# Altium schematic sheet Wheel Module.SchDoc
size A; DocumentNumber: 6; SheetNumber: 8; SheetTotal: 9
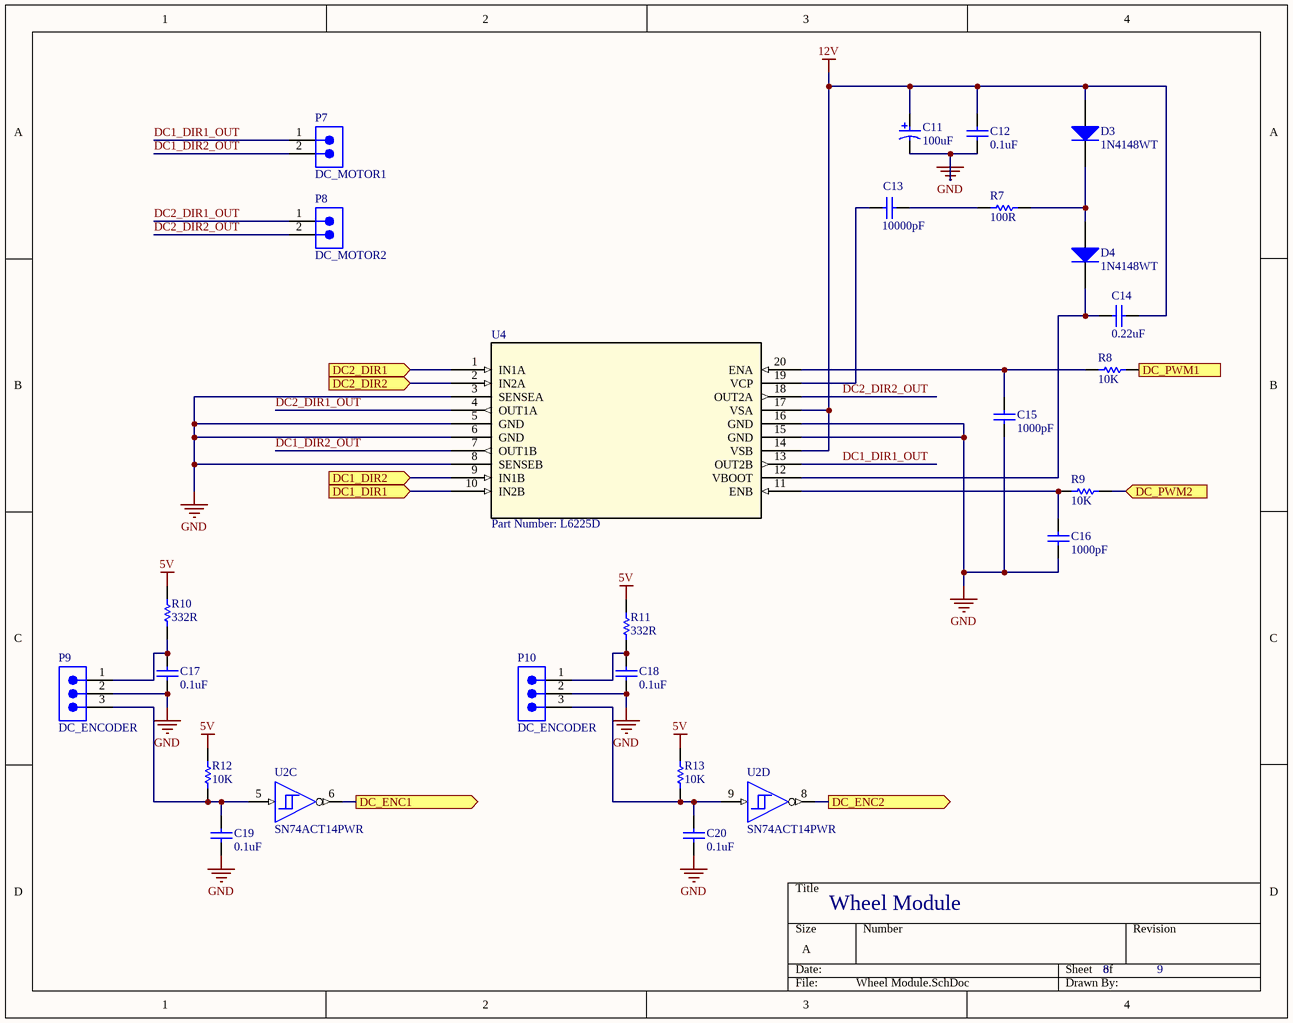
[diagram p0: Wheel Module.SchDoc]

## Parts
C11  100uF  [NIC-CAPA2-6.3X5.8_V]
C12  0.1uF  [CAPC1608X90X35LL15T15]
C13  10000pF  [CAPC1608X90X35LL15T15]
C14  0.22uF  [CAPC1608X90X35ML10T15]
C15  1000pF  [CAPC2013X140X50NL20T25]
C16  1000pF  [CAPC2013X140X50NL20T25]
C17  0.1uF  [CAPC1608X90X35LL15T15]
C18  0.1uF  [CAPC1608X90X35LL15T15]
C19  0.1uF  [CAPC1608X90X35LL15T15]
C20  0.1uF  [CAPC1608X90X35LL15T15]
D3  1N4148WT  [FAIR-SOD-523F-2_V]
D4  1N4148WT  [FAIR-SOD-523F-2_V]
P7  DC_MOTOR1  [SMTC-DW-02-16-X-S-200]
P8  DC_MOTOR2  [SMTC-DW-02-16-X-S-200]
P9  DC_ENCODER  [SMTC-TSW-103-07-X-S]
P10  DC_ENCODER  [SMTC-TSW-103-07-X-S]
R7  100R  [RESC1609X50X30ML10T20]
R8  10K  [RESC1609X50X30ML10T20]
R9  10K  [RESC1609X50X30ML10T20]
R10  332R  [RESC1608X55X30ML15T15]
R11  332R  [RESC1608X55X30ML15T15]
R12  10K  [RESC1609X50X30ML10T20]
R13  10K  [RESC1609X50X30ML10T20]
U2  SN74ACT14PWR  [PW0014A_N]  (parts C,D of 7)
U4  Part Number: L6225D  [SO-20]

## Ports
DC1_DIR1 (in), DC1_DIR2 (in), DC2_DIR1 (in), DC2_DIR2 (in), DC_ENC1 (out), DC_ENC2 (out), DC_PWM1 (in), DC_PWM2 (in)

## Nets
5V: R10.2 R11.2 R12.1 R13.1
12V: C11.1 C12.2 C14.2 D3.2(A) U4.14(VSB) U4.17(VSA)
GND: C11.2 C12.1 C15.1 C16.1 C17.1 C18.1 C19.1 C20.1 P9.2(Ground) P10.2(Ground) U4.3(SENSEA) U4.5(GND) U4.6(GND) U4.8(SENSEB) U4.15(GND) U4.16(GND)
DC1_DIR1: U4.10(IN2B) ; port DC1_DIR1
DC1_DIR1_OUT: P7.1 U4.13(OUT2B)
DC1_DIR2: U4.9(IN1B) ; port DC1_DIR2
DC1_DIR2_OUT: P7.2 U4.7(OUT1B)
DC2_DIR1: U4.1(IN1A) ; port DC2_DIR1
DC2_DIR1_OUT: P8.1 U4.4(OUT1A)
DC2_DIR2: U4.2(IN2A) ; port DC2_DIR2
DC2_DIR2_OUT: P8.2 U4.18(OUT2A)
DC_ENC1: U2.6(~{3Y}) ; port DC_ENC1
DC_ENC2: U2.8(~{4Y}) ; port DC_ENC2
DC_PWM1: R8.1 ; port DC_PWM1
DC_PWM2: R9.1 ; port DC_PWM2
NetC13_1: C13.1 U4.19(VCP)
NetC13_2: C13.2 R7.1
NetC14_1: C14.1 D4.1(K) U4.12(VBOOT)
NetC15_2: C15.2 R8.2 U4.20(ENA)
NetC16_2: C16.2 R9.2 U4.11(ENB)
NetC17_2: C17.2 P9.1(5V) R10.1
NetC18_2: C18.2 P10.1(5V) R11.1
NetC19_2: C19.2 P9.3(Signal) R12.2 U2.5(3A)
NetC20_2: C20.2 P10.3(Signal) R13.2 U2.9(4A)
NetD3_1: D3.1(K) D4.2(A) R7.2

## Notes on the sheet
- Wheel Module

## Library data of the parts
C11 = CMP-0687-00050-1: Aluminum Electrolytic Capacitor, UD Series, Low Impedance, 100 uF, 16 V, + / - 20%, -55 to 105 degC, Chip Type, 6.3 x 5.8 mm D x L, Pb-Free, Reel; PartNumber: UUD1C101MCL1GS; Manufacturer: Nichicon; Tolerance Rated Capacitance: -20 to 20%; Impedance: 0.44 Ohm; Rated Voltage: 16 V; Endurance Time: 2000 h; Packing: Dia382mm Reel; Rated Ripple Current (at 100kHz): 230 mA; PackageReference: CAPAE-D6.3H5.8; ComponentLink2URL: http://products.nichicon.co.jp/en/pdf/XJA043/e-ud.pdf; ComponentLink3Description: Package Specification; Mounting Technology: Surface Mount; Rated Capacitance: 100 uF; RoHS: TRUE; Diameter: 6.3 mm; Length: 5.8 mm; ComponentLink3URL: http://products.nichicon.co.jp/en/pdf/XJA043/e-ud.pdf; ComponentLink1Description: Manufacturer URL; ComponentLink2Description: Datasheet; PackageDescription: 2-Pin Surface Mount Device, Diameter 6.3 mm, Height 5.8 mm, Pitch 5.4 mm; DatasheetVersion: 08/2012; ComponentLink1URL: http://www.nichicon.co.jp/
C12 C17-C20 = CMP-2006-04389-2: Chip Capacitor, 100 nF, +/- 10%, 50 V, -55 to 125 degC, 0603 (1608 Metric), RoHS, Tape and Reel; Case\Package: 0603; Type (Capacitors): X7R; Capacitance: 100 nF; Voltage Rating: 50 V; Pins: 2; Max Operating Temperature: 125 degC; Min Operating Temperature: -55 degC; Case Code (Imperial): 0603; DatasheetVersion: 07/2016; Package Quantity: 4000; Length: 1.6 mm; REACH SVHC: No SVHC; Packaging: Tape and Reel; Case Code (Metric): 1608; Mounting Technology: Surface Mount; RoHSCompliant: true; Height: 0.9 mm; ComponentLink1URL: http://www.avx.com/; ComponentLink2URL: http://datasheets.avx.com/X7RDielectric.pdf; Mount: Surface Mount; ComponentLink2Description: Datasheet; Width: 0.81 mm; PackageReference: 0603; PackageDescription: 2-Pin Surface Mount Device, Body 1.6 x 0.81 mm; Radiation Hardening: No; ComponentLink1Description: Manufacturer URL; Voltage Rating (DC): 50 V; Tolerance: 10%
C13 = CMP-2006-04374-1: Manufacturer: AVX Interconnect / Elco; Part Number: 06035C-103KAT2A
C14 = CMP-2006-02784-1: Manufacturer: Murata; Part Number: GRM188F51H224ZA01D
C15 C16 = CMP-2007-04527-1: Manufacturer: AVX Interconnect / Elco; Part Number: 08051A102JAT2A
D3 D4 = CMP-0881-00001-1: High Conductance Fast Switching Diode, 75 V, -55 to 150 degC, 2-Pin SOD523F, RoHS; Manufacturer: Fairchild Semiconductor; IR (VR: 75 V)=5 uA Max.; VF: 1 V Max.; BVR (IR: 5 uA)=75 V Min.; CO: 4 pF Max.; DatasheetVersion: Rev. A2; ComponentLink1Description: Manufacturer URL; PackageDescription: 2-Pin Surface Mount Device, Body 1.2 x 0.8 mm, Height 0.7 mm; ComponentLink2URL: http://www.fairchildsemi.com/ds/1N/1N4148WT.pdf; ComponentLink2Description: Datasheet; PartNumber: 1N4148WT; ComponentLink1URL: http://www.fairchildsemi.com/; Temperature Range: -55 to 150 degC; Mounting Technology: Surface Mount; PackageReference: SOD-523F-2; RoHS: TRUE
P7 P8 = CMP-1024-00001-1: Flexible .025" SQ Board Stacker, Through-hole, Vertical, -55 to 125 degC, 2.54 mm Pitch, 2-Pin, Male, RoHS; PartNumber: DW-02-16-G-S-200; Manufacturer: Samtec; Pitch: 2.54 mm; ComponentLink1Description: Manufacturer URL; ComponentLink3Description: Package Specification; DatasheetVersion: F-214; ComponentLink1URL: http://www.samtec.com; RoHS: True; PackageVersion: AX, 8/1984; ComponentLink2URL: http://www.samtec.com/documents/webfiles/pdf/DW.PDF; ComponentLink2Description: Datasheet; Orientation: Vertical; PackageReference: DW-02-16-X-S-200; PackageDescription: Low Cost Board Spacer; ComponentLink3URL: http://www.samtec.com/documents/webfiles/cpdf/XW-XX-XX-XXX-X-XXXX-XXX-XX-XXX-MKT1.PDF; Mounting Technology: Through-hole; Temperature Range: -55 to 125 degC
P9 P10 = CMP-1024-00334-1: 0.025" SQ Post Header, Through-hole, Vertical, -55 to 125 degC, 2.54 mm Pitch, 3-Pin, Male, RoHS; Manufacturer: Samtec; PartNumber: TSW-103-07-L-S; Pitch: 2.54 mm; Mounting Technology: Through-hole; ComponentLink2URL: http://www.samtec.com/documents/webfiles/pdf/TSW_TH.PDF; ComponentLink3Description: Package Specification; PackageVersion: DM, 8/1988; PackageReference: TSW-103-07-X-S; Orientation: Vertical; ComponentLink1URL: http://www.samtec.com; PackageDescription: .025[0.64] SQ. Post Terminal Strip Assembly; ComponentLink1Description: Manufacturer URL; ComponentLink2Description: Datasheet; ComponentLink3URL: http://www.samtec.com/documents/webfiles/cpdf/TSW-XXX-XX-XXX-X-XX-XXX-MKT.pdf; RoHS: True; DatasheetVersion: F-214; Temperature Range: -55 to 125 degC
R7 = CMP-2000-03827-1: Part Number: CRCW0603100RJNEA; Manufacturer: Vishay Dale
R8 R9 R12 R13 = CMP-2000-03838-1: Manufacturer: Vishay Dale; Part Number: CRCW060310K0JNEA
R10 R11 = CMP-2000-00439-1: Part Number: ERJ-3EKF3320V; Manufacturer: Panasonic
U2 = CMP-0268-00001-5: Hex Schmitt-Trigger Inverters, PW0014A, LARGE T&R; Manufacturer: Texas Instruments; Voltage(Nom)(V): 5; F @ Nom Voltage(Max)(Mhz): 90; Input Type: TTL; tpd @ Nom Voltage(Max)(ns): 12.5; Output Type: CMOS; Bits(#): 6; VCC(Max)(V): 5.5; Technology Family: ACT; Output Drive (IOL/IOH)(Max)(mA): -24/24; ICC @ Nom Voltage(Max)(mA): 0.02; Schmitt Trigger: Yes; VCC(Min)(V): 4.5; Rating: Catalog; Code_JEDEC: MO-153; PackageReference: PW0014A; Operating Temperature Range(C): -40 to 85; Generic Part Number: SN74ACT14; DatasheetVersion: SCAS557H
U4 = L6225D: No Description Available; Vendor: STMicroelectronics; Built_By: EMA_UL_Team; Manufacturer_Part_Number: L6225D; Copyright: Copyright (C) 2018 Accelerated Designs. All rights reserved; RefDes: RefDes; Type: DEV; Value: Value